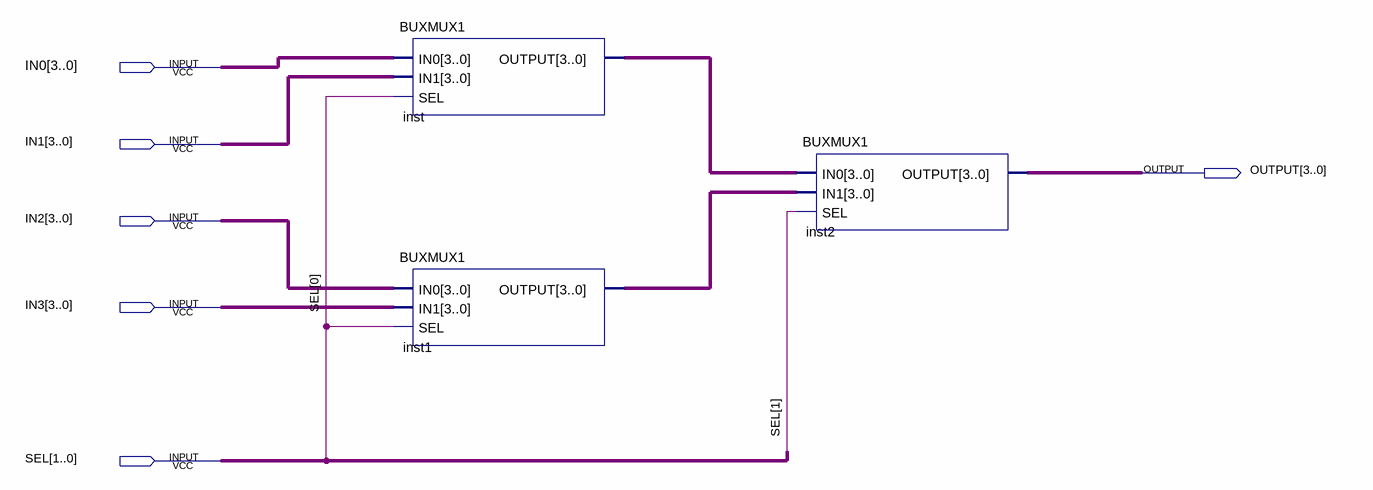
[diagram p0: schematic sheet]
// Quartus schematic BUSMUX4.bdf as structural Verilog: 3 symbols, 6 pins
module BUSMUX4 (
  input  [3:0] IN0,
  input  [3:0] IN1,
  input  [3:0] IN2,
  input  [3:0] IN3,
  input  [1:0] SEL,
  output [3:0] OUTPUT
);

  wire [3:0] inst1_output, inst_output;

  BUXMUX1 inst (.IN0(IN0), .IN1(IN1), .SEL(SEL[0]), .OUTPUT(inst_output));
  BUXMUX1 inst1 (.IN0(IN2), .IN1(IN3), .SEL(SEL[0]), .OUTPUT(inst1_output));
  BUXMUX1 inst2 (.IN0(inst_output), .IN1(inst1_output), .SEL(SEL[1]), .OUTPUT(OUTPUT));
endmodule
